# Altium project MiniRelay.PrjPcb
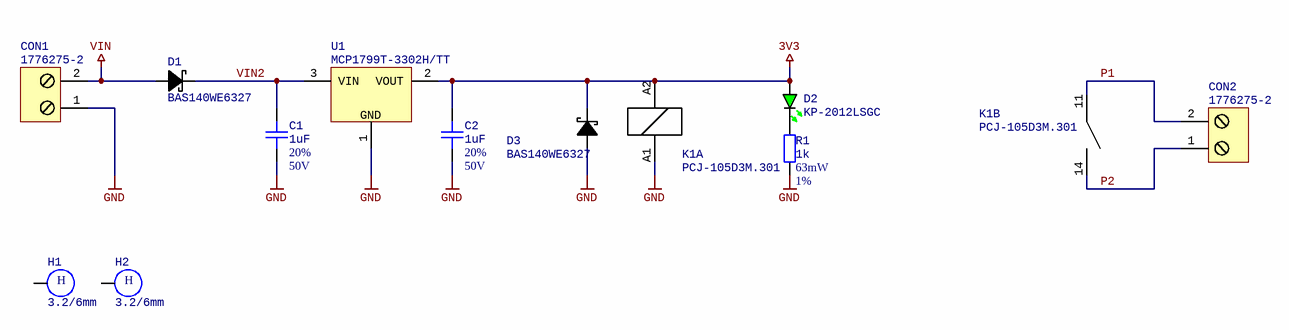
[diagram p0: MiniRelay.SchDoc]
Author: Lukasz Przenioslo; CompanyName: Przenioslo Electronics & Software; Engineer: lukasz@przenioslo.com; Revision: A
1 sheet, 12 parts. Net scope: strictly hierarchical (ports join the sheet entries above them; power ports are local).
Board file: MiniRelay_revA.PcbDoc

## Sheet MiniRelay.SchDoc: Single 9mm, TH35/ DIN rail mini relay module.
size A4; Date: 2023-06-15; Author: Łukasz Przeniosło; CompanyName: Przenioslo Electronics & Software; DrawnBy: Coil voltage = 5 - 35 V, Poles voltage = 230 VAC.; Engineer: lukasz@przenioslo.com; Organization: PRZENIOSLO; Address1: Electronics; Address2: &; Address3: Software; SheetNumber: 1; SheetTotal: 1

### Parts
C1  1uF  Tolerance: 20%  Voltage: 50V  [CAP0805]
C2  1uF  Tolerance: 20%  Voltage: 50V  [CAP0805]
CON1  1776275-2  [Terminal-block-2way-5.0]
CON2  1776275-2  [Terminal-block-2way-5.0]
D1  BAS140WE6327  [SOD323]
D2  KP-2012LSGC  [0805_LED_GRN]
D3  BAS140WE6327  [SOD323]
H1  3.2/6mm  [Hole-3.2/0]  (no BOM)
H2  3.2/6mm  [Hole-3.2/0]  (no BOM)
K1  PCJ-105D3M.301  [1721081-2]  (parts A,B of 2)
R1  1k  Power: 63mW  Tolerance: 1%  [RES0603]
U1  MCP1799T-3302H/TT  [SOT23-3L]

### Nets
3V3: C2.1 D2.2(A) D3.1(K) K1.A2 U1.2(VOUT)
GND: C1.2 C2.2 CON1.1 D3.2(A) K1.A1 R1.1 U1.1(GND)
VIN: CON1.2 D1.2(A)
P1: CON2.2 K1.11  [project net P1_1]
P2: CON2.1 K1.14  [project net P2_1]
VIN2: C1.1 D1.1(K) U1.3(VIN)  [project net VIN2_1]
NetD2_1: D2.1(K) R1.2

Not connected (* = marked no-connect by the designer): H1 1; H2 1

### Notes on the sheet
- Title:
- Project:
- Rev:
- Address:
- Description:
- Created:
- Author:
- Company:
- Edited:
- Contact:
- Sheet
- of
- Ofiar Katynia 21
- 72-100 Goleniów
- Poland
- File:
- (in symbol hole_metalized) H

### Library data of the parts
C1 C2 = Capacitor: Type: Ceramic; Dielectric: X5R; Value: 1uF
CON1 CON2 = Terminal Block 2: Screwed terminal block with 2 pins; Manufacturer: TE Connectivity; Identifier: 1776275-2
D1 D3 = BAS140W: Silicon Schottky Diode. General-purpose diode for high-speed switching; Manufacturer: Infineon; V_R: 40V; I_F: 120mA; V_F: 1V; Identifier: BAS140WE6327
D2 = KP-2012LSGC: LED; SMD; 0805; green; 0.2÷0.5mcd; 2x1.25x1.1mm; 160°; 1.9÷2.25V; Manufacturer: KINGBRIGHT ELECTRONIC; Forward current: 2mA; Forward voltage: 1.9...2.25V; Identifier: KP-2012LSGC; Color: Green
H1 H2 = hole_metalized: Generic hole component with 1 electrical connection; size: 3.2/6mm
K1 = PCJ-1xxD3M.301: Miniature PCB Relay PCJ; Manufacturer: TE Connectivity; Identifier: PCJ-105D3M.301
R1 = Resistor: Generic resistor symbol; Value: 1k; Manufacturer: *; Identifier: *; Datasheet: *
U1 = MCP1799T-xx02H/TT: IC: voltage regulator; LDO,linear,fixed; 3.3V/5V; 80mA; SOT23; SMD; Manufacturer: Microchip; VoltageMinInput: 4.5/6.2V; VoltageMinOutput: 3.3/5V; VoltageMaxInput: 45V; Identifier: MCP1799T-3302H/TT; VoltageMaxOutput: 3.3/5V; CurrentMaxOut: 80mA